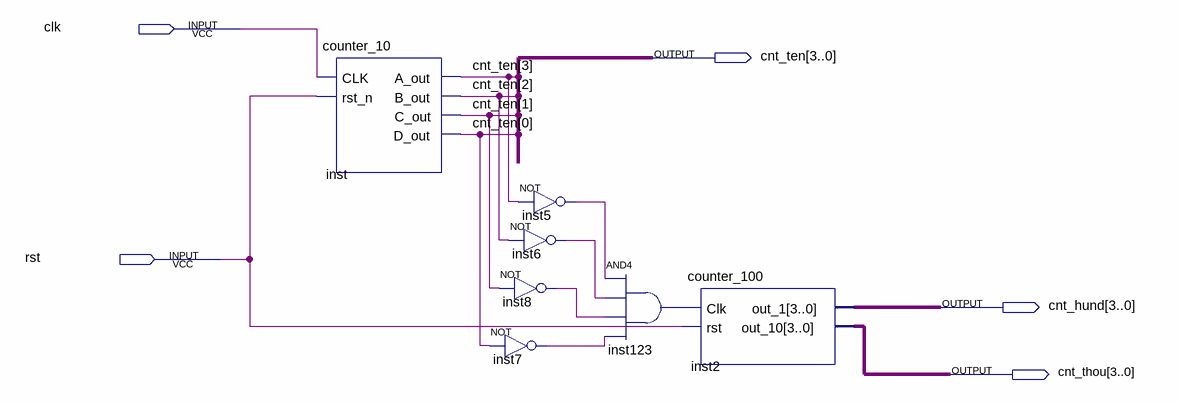
[diagram p0: schematic sheet]
// Quartus schematic count_1000.bdf as structural Verilog: 7 symbols, 5 pins
module count_1000 (
  input  clk,
  input  rst,
  output [3:0] cnt_ten,
  output [3:0] cnt_hund,
  output [3:0] cnt_thou
);

  wire inst5_out, inst6_out, inst7_out, inst8_out, inst123_out;

  counter_10 inst (
    .CLK(clk), .rst_n(rst), .A_out(cnt_ten[3]), .B_out(cnt_ten[2]), .C_out(cnt_ten[1]), .D_out(cnt_ten[0]));
  not inst5 (inst5_out, cnt_ten[3]);
  not inst6 (inst6_out, cnt_ten[2]);
  not inst8 (inst8_out, cnt_ten[1]);
  not inst7 (inst7_out, cnt_ten[0]);
  and inst123 (inst123_out, inst5_out, inst6_out, inst8_out, inst7_out);
  counter_100 inst2 (.Clk(inst123_out), .rst(rst), .out_1(cnt_hund), .out_10(cnt_thou));
endmodule
